# EasyEDA schematic SCH_pump_2021-09-05.easyeda.json
TITLE: pump automation; REV: 1.0; Date: 2021-08-30; Sheet: 1/1; Drawn By: osetroff; Company: osetroff
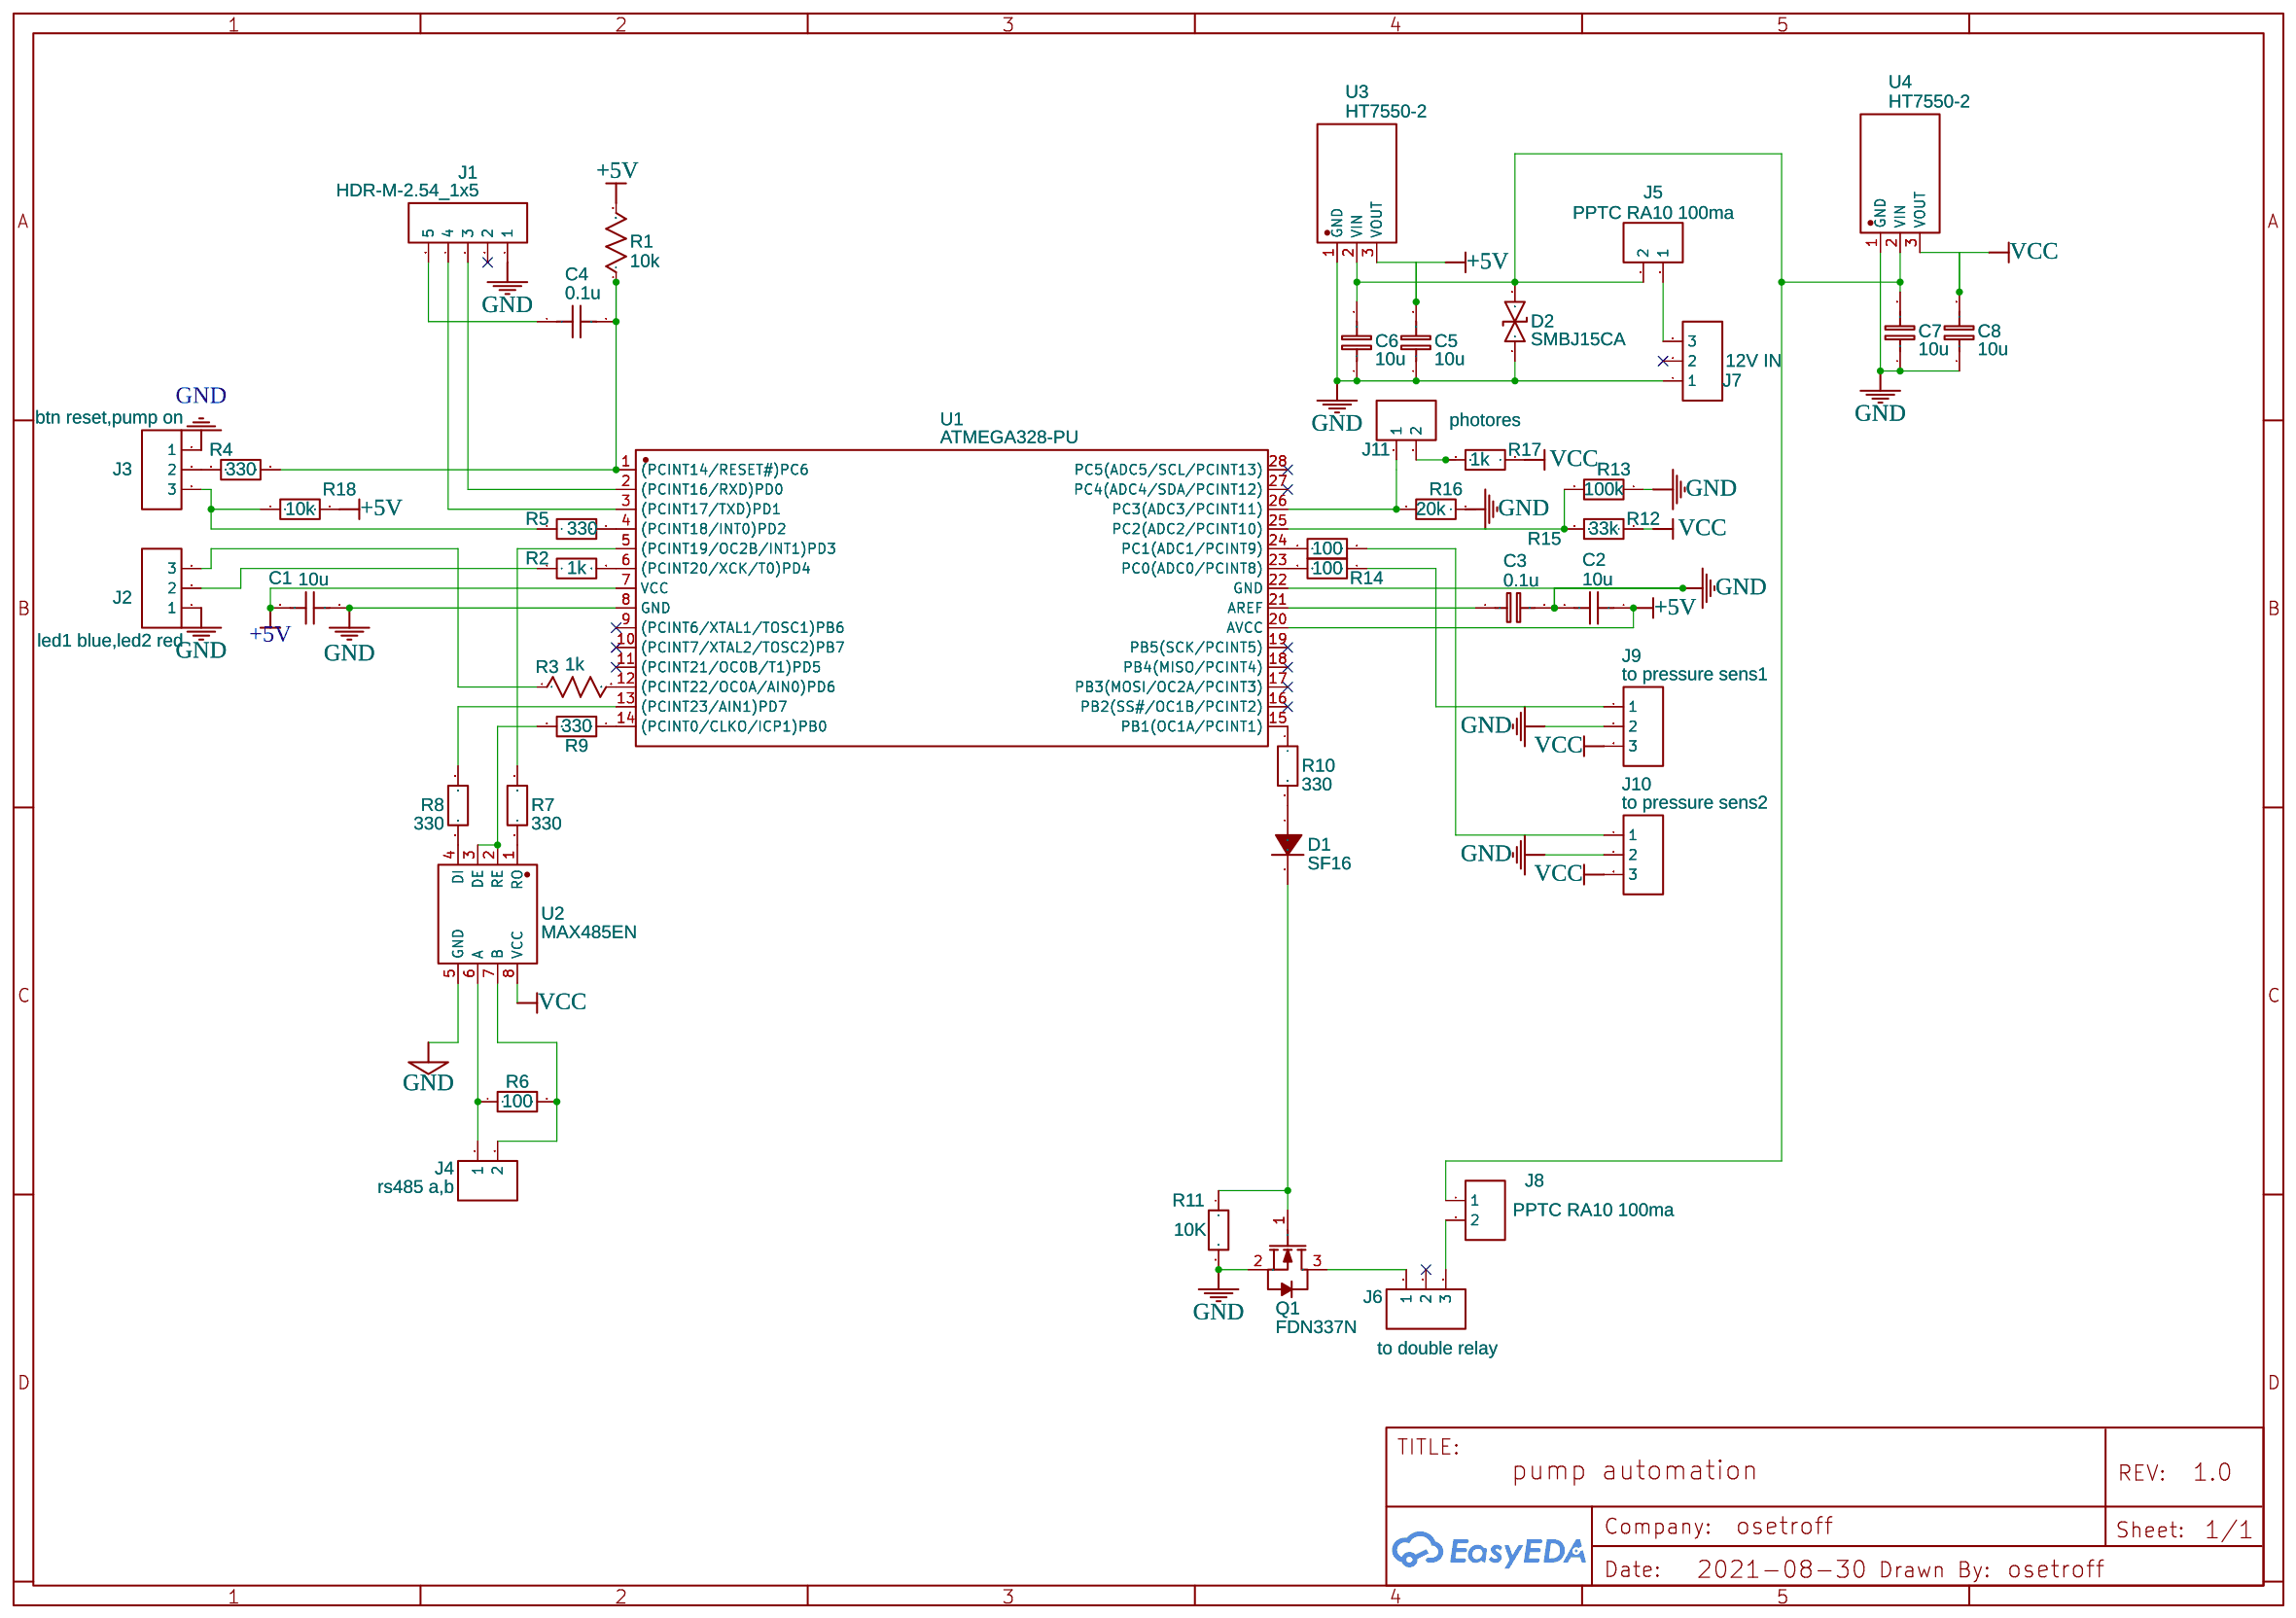
[diagram p0: schematic sheet]

## Parts
C1  10u  [C0603]
C2  10u  [C0603]
C3  0.1u  [C0603]
C4  0.1u  [C0603]
C5  10u  [C0603]
C6  10u  [C0603]
C7  10u  [C0603]
C8  10u  [C0603]
D1  SF16  [DO-41_BD2.4-L4.7-P8.70-D0.9-FD]
D2  SMBJ15CA  [SMB_L4.6-W3.6-LS5.3-BI]
J1  HDR-M-2.54_1x5  [HDR-M-2.54_1X5]
J2  led1 blue,led2 red  [HDR-M-2.54_1X3]
J3  btn reset,pump on  [HDR-M-2.54_1X3]
J4  rs485 a,b  [HDR-M-2.54_1X2]
J5  PPTC RA10 100ma  [HDR-M-2.54_1X2]
J6  to double relay  [HDR-M-2.54_1X3]
J7  12V IN  [HDR-M-2.54_1X3]
J8  PPTC RA10 100ma  [HDR-M-2.54_1X2]
J9  to pressure sens1  [HDR-M-2.54_1X3]
J10  to pressure sens2  [HDR-M-2.54_1X3]
J11  photores  [HDR-M-2.54_1X2]
Q1  FDN337N  [SOT-23-3_L3.0-W1.7-P0.95-LS2.9-BR]
R1  10k  [R0603]
R2  1k  [R0603]
R3  1k  [R0603]
R4  330  [R0603]
R5  330  [R0603]
R6  100  [R0603]
R7  330  [R0603]
R8  330  [R0603]
R9  330  [R0603]
R10  330  [R0603]
R11  10K  [R0603]
R12  33k  [R0603]
R13  100k  [R0603]
R14  100  [R0603]
R15  100  [R0603]
R16  20k  [R0603]
R17  1k  [R0603]
R18  10k  [R0603]
U1  ATMEGA328-PU  [DIP-28_L35.0-W6.5-P2.54-LS7.6-BL]
U2  MAX485EN  [DIP-8_L10.0-W6.5-P2.54-LS7.6-BL]
U3  HT7550-2  [SOT-89-3_L4.5-W2.5-P1.50-LS4.2-BR]
U4  HT7550-2  [SOT-89-3_L4.5-W2.5-P1.50-LS4.2-BR]

## Library data of the parts
C1 C2 C4 = C_0603_US: Contributor: LCEDA_Lib
C3 C5-C8 = C_0603_EU: Contributor: LCEDA_Lib
D1 = SF16: Supplier: LCSC; Manufacturer: MDD; Supplier Part: C65035; JLCPCB Part Class: Extended Part
D2 = SMBJ15CA: Supplier Part: C169449; Supplier: LCSC; Manufacturer: Jingdao; Contributor: LCSC; JLCPCB Part Class: Extended Part
J1 = HDR-M-2.54_1x5: Supplier Part: C358687; Supplier: LCSC; Contributor: LCEDA_Lib
J2 J3 J6 J7 J9 J10 = HDR-M-2.54_1x3: Supplier Part: C180248; Supplier: LCSC; Contributor: LCEDA_Lib
J4 J5 J8 J11 = HDR-M-2.54_1x2: Supplier Part: C124375; Supplier: LCSC; Contributor: LCEDA_Lib
Q1 = FDN337N: Supplier: LCSC; Supplier Part: C241805; Manufacturer: ON Semicon; Contributor: LCSC; JLCPCB Part Class: Extended Part
R1 R3 = R_0603_US: Contributor: LCEDA_Lib
R2 R4-R18 = R_0603_EU: Contributor: LCEDA_Lib
U1 = ATMEGA328-PU: Supplier: LCSC; Supplier Part: C613508; Manufacturer: MICROCHIP(美国微芯); Contributor: LCSC; JLCPCB Part Class: Extended Part
U2 = MAX485EN: Supplier: LCSC; Supplier Part: C481665; Manufacturer: HTC Korea TAEJIN Tech; Contributor: LCSC; JLCPCB Part Class: Extended Part
U3 U4 = HT7550-2: Supplier: LCSC; Manufacturer: HOLTEK; Contributor: LCSC; Supplier Part: C131464; JLCPCB Part Class: Extended Part

## Nets
+5V: C1.2 C2.1 C5.2 R1.2 R18.2 U1.7(VCC) U1.20(AVCC) U3.3(VOUT)
GND: C1.1 C2.2 C3.2 C5.1 C6.1 C7.1 C8.1 D2.1 J1.1 J2.1 J3.1 J7.1 J9.2 J10.2 Q1.2(S) R11.2 R13.1 R16.1 U1.8(GND) U1.22(GND) U2.5(GND) U3.1(GND) U4.1(GND)
VCC: C8.2 J9.3 J10.3 R12.1 R17.1 U2.8(VCC) U4.3(VOUT)
Net-(C3-1): C3.1 U1.21(AREF)
Net-(C4-1): C4.1 J1.5
Net-(C4-2): C4.2 R1.1 R4.2 U1.1((PCINT14/RESET#)PC6)
Net-(C6-2): C6.2 C7.2 D2.2 J5.2 J8.1 U3.2(VIN) U4.2(VIN)
Net-(D1-1): D1.1(A) R10.2
Net-(D1-2): D1.2(C) Q1.1(G) R11.1
Net-(J1-3): J1.3 U1.2((PCINT16/RXD)PD0)
Net-(J1-4): J1.4 U1.3((PCINT17/TXD)PD1)
Net-(J2-2): J2.2 R2.1
Net-(J2-3): J2.3 R3.1
Net-(J3-2): J3.2 R4.1
Net-(J3-3): J3.3 R5.1 R18.1
Net-(J4-1): J4.1 R6.1 U2.6(A)
Net-(J4-2): J4.2 R6.2 U2.7(B)
Net-(J5-1): J5.1 J7.3
Net-(J6-1): J6.1 Q1.3(D)
Net-(J6-3): J6.3 J8.2
Net-(J9-1): J9.1 R14.1
Net-(J10-1): J10.1 R15.1
Net-(J11-1): J11.1 R16.2 U1.26(PC3(ADC3/PCINT11))
Net-(J11-2): J11.2 R17.2
Net-(R2-2): R2.2 U1.6((PCINT20/XCK/T0)PD4)
Net-(R3-2): R3.2 U1.12((PCINT22/OC0A/AIN0)PD6)
Net-(R5-2): R5.2 U1.4((PCINT18/INT0)PD2)
Net-(R7-1): R7.1 U2.1(RO)
Net-(R7-2): R7.2 U1.5((PCINT19/OC2B/INT1)PD3)
Net-(R8-1): R8.1 U1.13((PCINT23/AIN1)PD7)
Net-(R8-2): R8.2 U2.4(DI)
Net-(R9-1): R9.1 U1.14((PCINT0/CLKO/ICP1)PB0)
Net-(R9-2): R9.2 U2.2(RE) U2.3(DE)
Net-(R10-1): R10.1 U1.15(PB1(OC1A/PCINT1))
Net-(R12-2): R12.2 R13.2 U1.25(PC2(ADC2/PCINT10))
Net-(R14-2): R14.2 U1.23(PC0(ADC0/PCINT8))
Net-(R15-2): R15.2 U1.24(PC1(ADC1/PCINT9))

Not connected (* = marked no-connect by the designer): J1 2*; J6 2*; J7 2*; U1 9((PCINT6/XTAL1/TOSC1)PB6)* 10((PCINT7/XTAL2/TOSC2)PB7)* 11((PCINT21/OC0B/T1)PD5)* 16(PB2(SS#/OC1B/PCINT2))* 17(PB3(MOSI/OC2A/PCINT3))* 18(PB4(MISO/PCINT4))* 19(PB5(SCK/PCINT5))* 27(PC4(ADC4/SDA/PCINT12))* 28(PC5(ADC5/SCL/PCINT13))*
